# EAGLE design SchematicLAB-4 (EAGLE 9.6.2)
DRAWING_AUTHOR: SANTOS | CANONOE | VILLEGAS - BSCOE 2-1
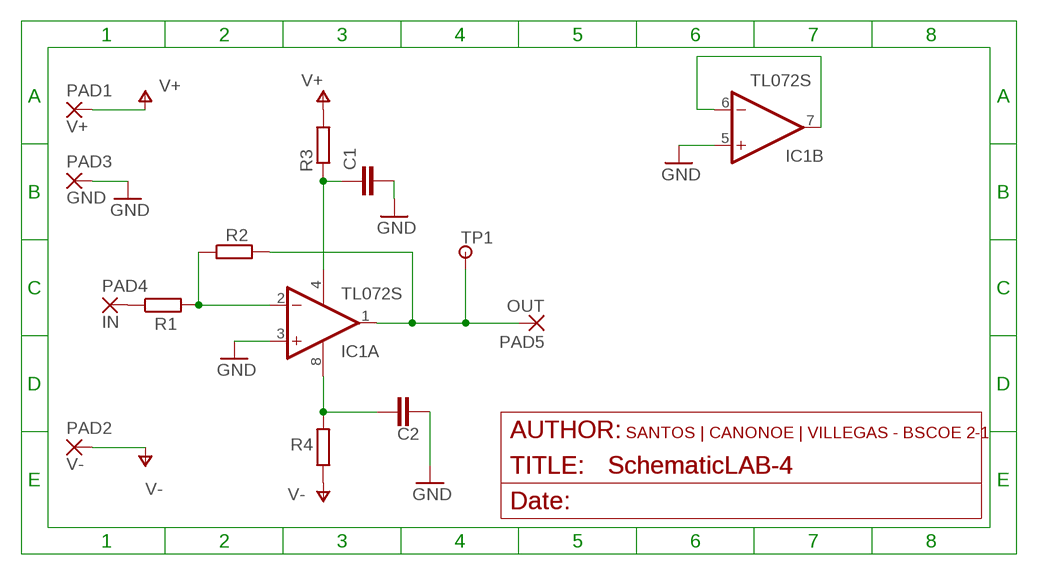
[diagram p0: schematic, sheet 1]

## Parts
C1  C2.5P  [C025-030X050]
C2  C2.5P  [C025-030X050]
IC1  TL072S  [SOCKED-08]
PAD1  V+  PAD-TERMINAL  [2,54/1,1]
PAD2  V-  PAD-TERMINAL  [2,54/1,1]
PAD3  GND  PAD-TERMINAL  [2,54/1,1]
PAD4  IN  PAD-TERMINAL  [2,54/1,1]
PAD5  OUT  PAD-TERMINAL  [2,54/1,1]
R1  R  [0207/10]
R2  R  [0207/10]
R3  R  [0207/10]
R4  R  [0207/10]
TP1  PAD-TESTPOINT  [1,6/0,8]

## Nets
GND: C1.2 C2.1 IC1.3(A:+IN) IC1.5(B:+IN) PAD3.1(P)
N$1: PAD4.1(P) R1.1
N$2: IC1.2(A:-IN) R1.2 R2.1
N$3: C1.1 IC1.4(A:V-) R3.1
N$4: IC1.1(A:OUT) PAD5.1(P) R2.2 TP1.1(P)
N$5: C2.2 IC1.8(A:V+) R4.2
N$6: IC1.6(B:-IN) IC1.7(B:OUT)
V+: PAD1.1(P) R3.2
V-: PAD2.1(P) R4.1

## Library data of the parts
C1 C2 = ee2parts:C: Capacitor
IC1 = ee2parts:TL072
PAD1-PAD5 = ee2parts:PAD-TERMINAL: LARGE THROUGH-HOLE PAD Large pad for mounting PCB pin for convenient prototype off-board connections
R1-R4 = ee2parts:R: Resistor
TP1 = ee2parts:PAD-TESTPOINT: SMALL THROUGH-HOLE PAD/TESTPOINT Pad suitable for use as a test point (no pin)

## Board
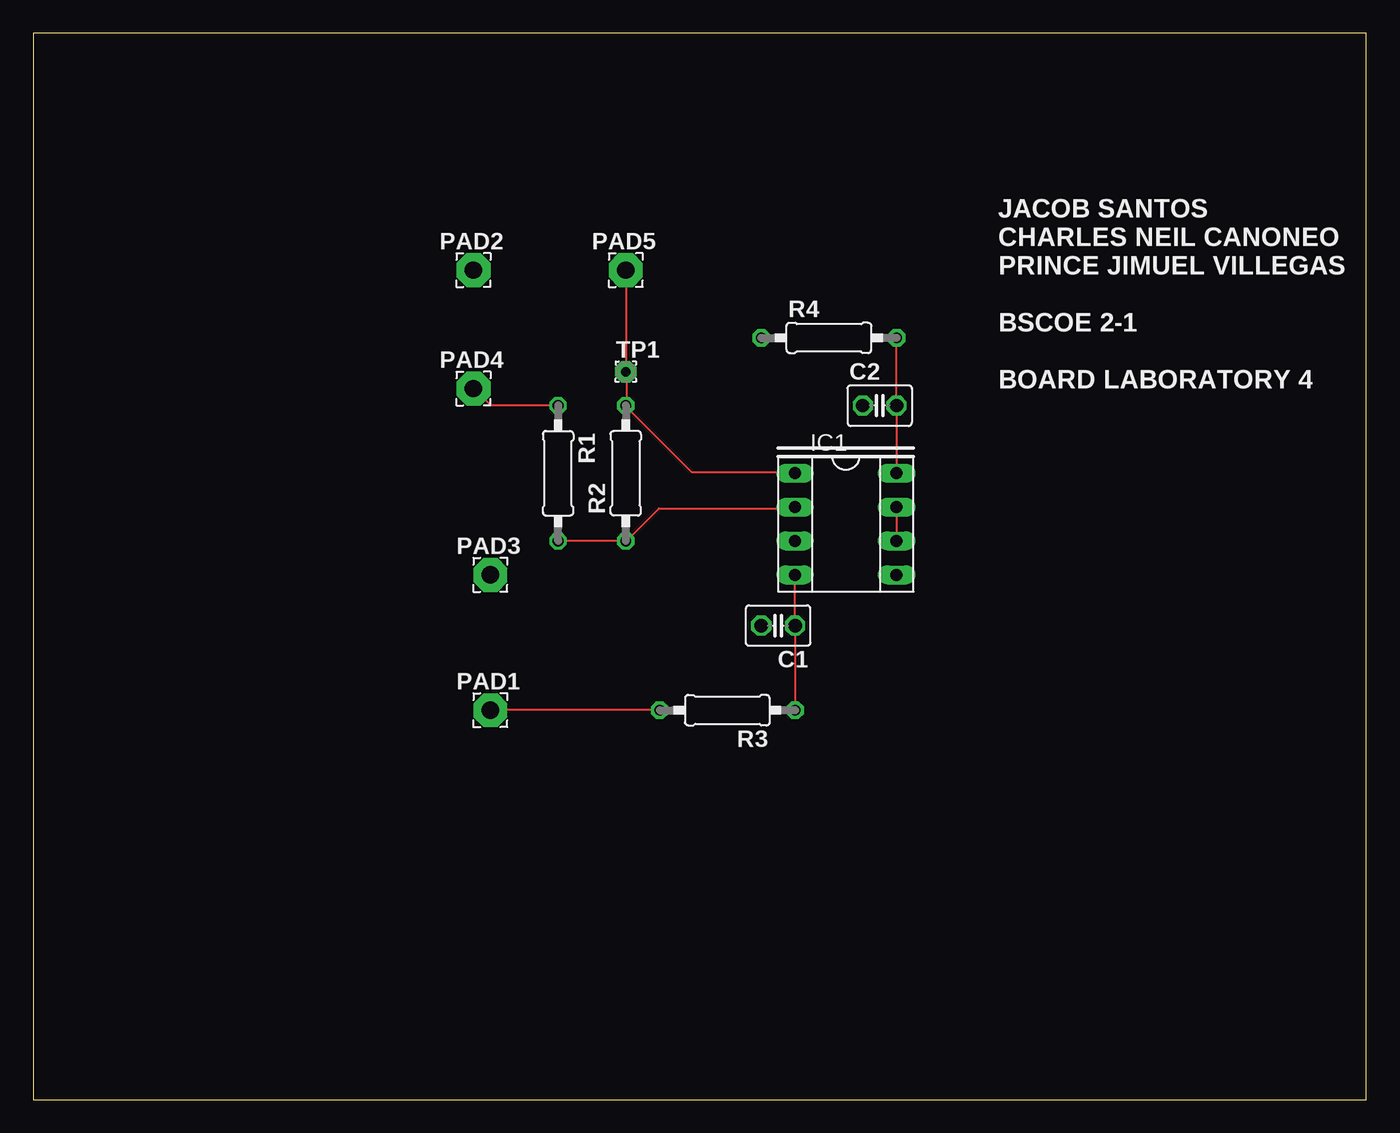
[diagram p1: board, top side]
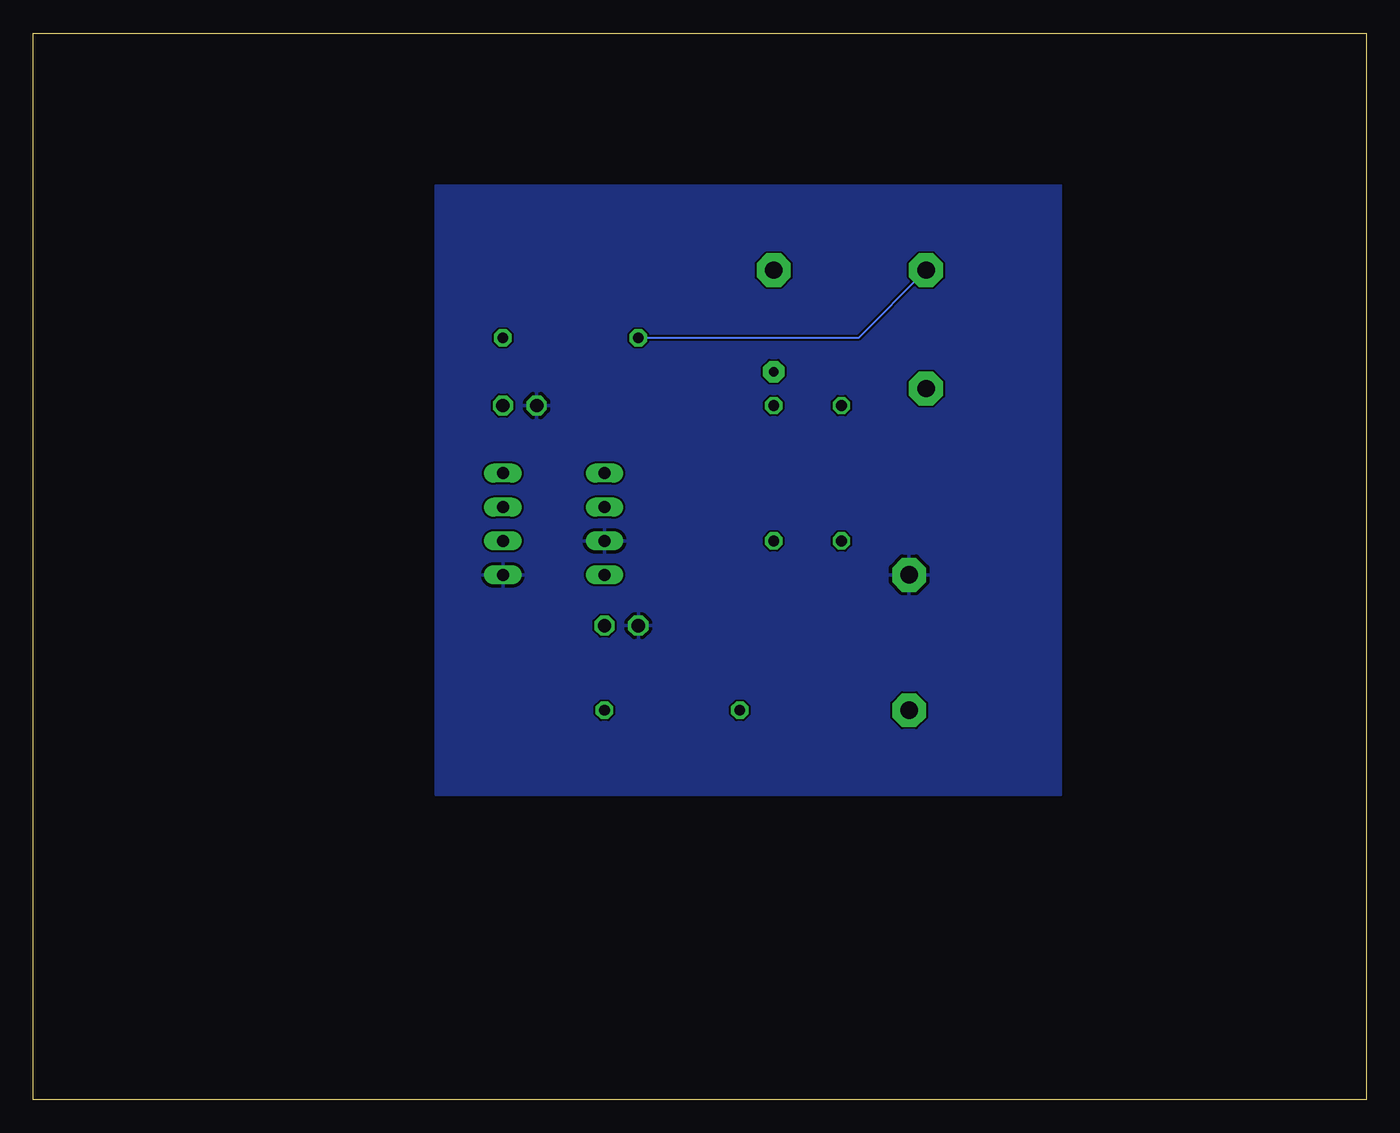
[diagram p2: board, bottom side, seen from below]

Size 100 x 80 mm. Coordinates in mm from the lower left corner, seen from the top.
Outline: 0,0 100,0 100,80 0,80 0,0
Copper layers (1*16): Top 0.035mm / dielectric 1.5mm / Bottom 0.035mm
Design rules "default": minimum track width 6mil, minimum drill 0.35mm, track to track 6mil, track to pad 6mil, pad to pad 6mil, via to via 6mil, smd to smd 6mil, copper to edge 40mil, drill to drill 6mil, minimum pad ring 10mil, minimum via ring 8mil, stop-mask expansion 4mil, vias tented up to drill 0mil, thermal gap 10mil

### Footprints (pad centres in the part's own frame; a part is rotated, then mirrored left to right if it is on the bottom)
C025-030X050 = drill 1 octagon: 1 -1.27,0; 2 1.27,0
SOCKED-08 = drill 0.9 long: 1 -3.81,-3.81; 2 -1.27,-3.81; 3 1.27,-3.81; 4 3.81,-3.81; 5 3.81,3.81; 6 1.27,3.81; 7 -1.27,3.81; 8 -3.81,3.81
2,54/1,1 = drill 1.3 pad 2.54 octagon: 1 0,0
0207/10 = drill 0.8 octagon: 1 -5.08,0; 2 5.08,0
1,6/0,8 = drill 0.7 pad 1.6 octagon: 1 0,0

### Placement (x,y rotation side)
C1  55.88,35.56 180 top
C2  63.5,52.07 0 top
IC1  60.96,43.18 270 top
PAD1  34.29,29.21 0 top
PAD2  33.02,62.23 0 top
PAD3  34.29,39.37 0 top
PAD4  33.02,53.34 0 top
PAD5  44.45,62.23 0 top
R1  39.37,46.99 270 top
R2  44.45,46.99 90 top
R3  52.07,29.21 180 top
R4  59.69,57.15 0 top
TP1  44.45,54.61 0 top

### Tracks (layer width: path | path; a pad name or v marks a point on that pad's centre or on a via)
GND
  pour Bottom: 22.86,68.58 69.85,68.58 69.85,25.4 69.85,22.86 22.86,22.86
N$1
  Top 0.152: R1.1 39.32,52.12 34.29,52.12 33.07,53.34 PAD4.1
N$2
  Top 0.152: R1.2 R2.1 44.5,41.91 46.94,44.35 57.15,44.35 IC1.2
N$3
  Top 0.152: R3.1 C1.1 IC1.4
N$4
  Top 0.152: IC1.1 57.15,47.09 49.38,47.09 44.5,51.97 R2.2 44.5,52.12 44.5,54.56 TP1.1 PAD5.1
N$5
  Top 0.152: R4.2 C2.2 IC1.8
N$6
  Top 0.152: IC1.7 IC1.6
V+
  Top 0.152: R3.2 46.94,29.26 34.29,29.26 PAD1.1
V-
  Bottom 0.152: R4.1 38.1,57.15 PAD2.1

### Text on the board
tPlace: JACOB SANTOS / CHARLES NEIL CANONEO / PRINCE JIMUEL VILLEGAS / / BSCOE 2-1 / / BOARD LABORATORY 4